# Altium schematic sheet Sheet2.SchDoc
size A4
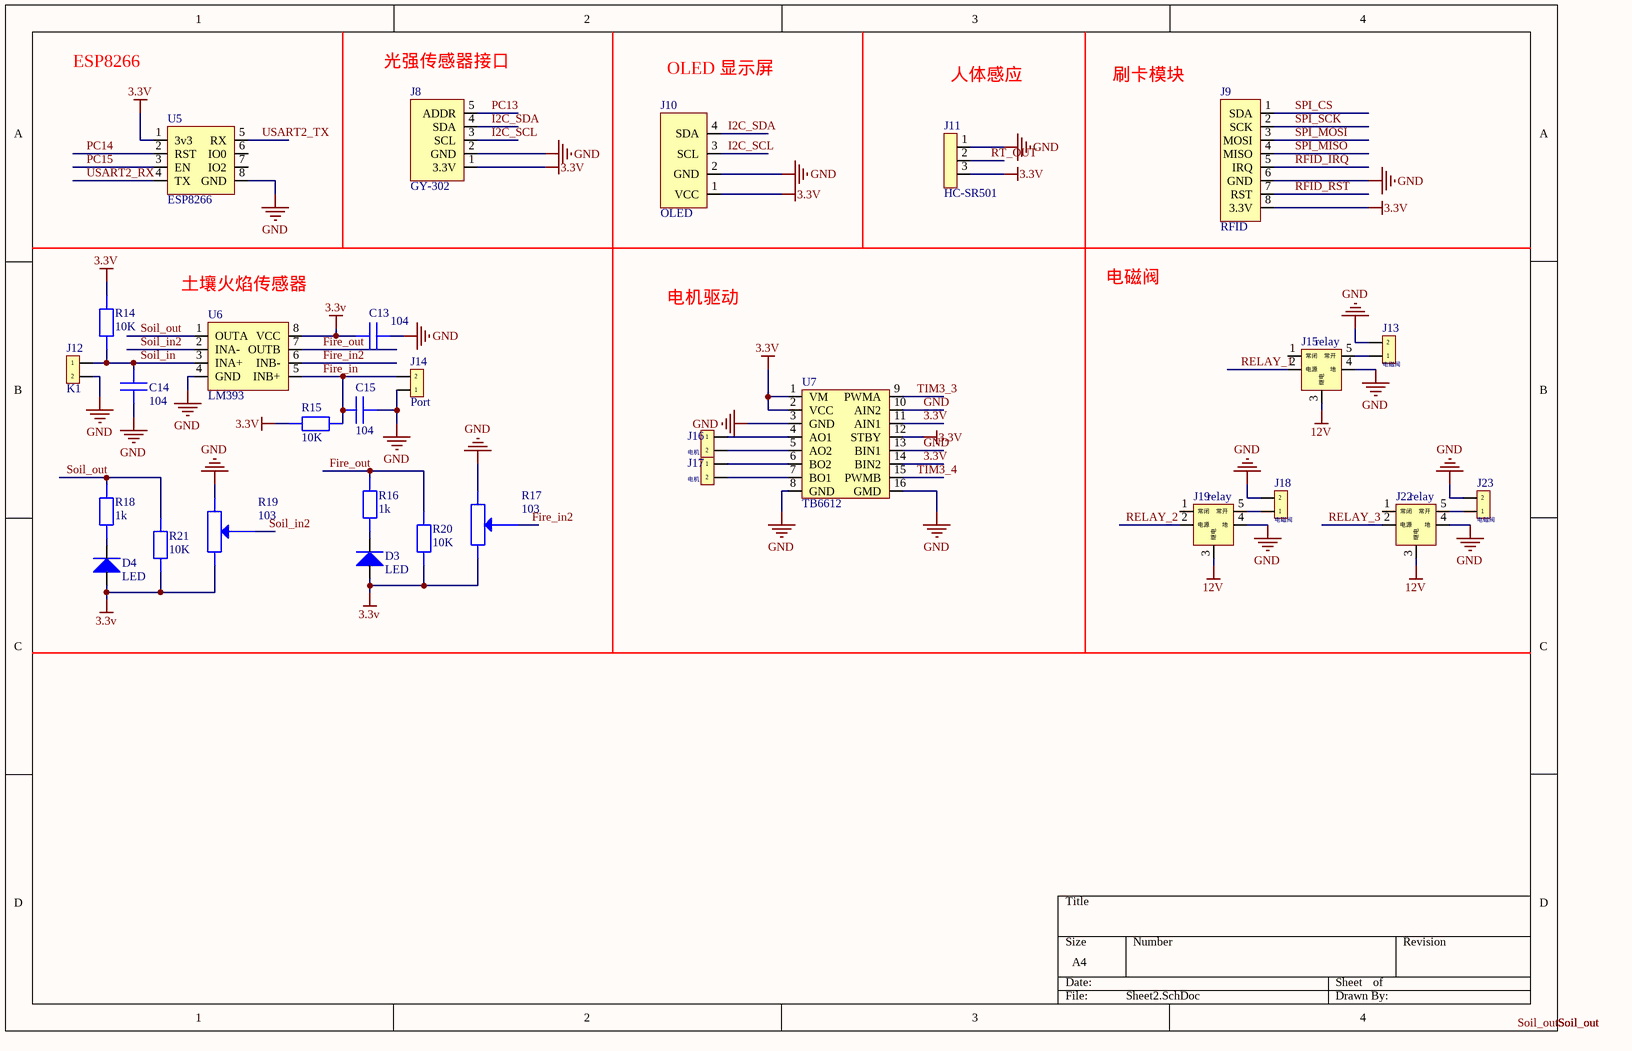
[diagram p0: Sheet2.SchDoc]

## Parts
C13  104  [CAP_0603_FIRE]
C14  104  [CAP_0603_FIRE]
C15  104  [CAP_0603_FIRE]
D3  LED  [LED_Z]
D4  LED  [LED_Z]
J8  GY-302  [GY]
J9  RFID  [RFID]
J10  OLED  [OLED]
J11  HC-SR501  [HDR1X3]
J12  K1  [port_2]
J13  电磁阀  [port_2]
J14  Port  [port_2]
J15  relay  [relay]
J16  电机  [port_2]
J17  电机  [port_2]
J18  电磁阀  [port_2]
J19  relay  [relay]
J22  relay  [relay]
J23  电磁阀  [port_2]
R14  10K  [R_0603]
R15  10K  [R_0603]
R16  1k  [R_0603]
R17  103  [RES_R]
R18  1k  [R_0603]
R19  103  [RES_R]
R20  10K  [R_0603]
R21  10K  [R_0603]
U5  ESP8266  [ESP8266]
U6  LM393  [LM393]
U7  TB6612  [TB6612]

## Nets
3.3V: C13.1 D3.1 D4.1 J8.1(3.3V) J9.8(3.3V) J10.1(VCC) J11.3 R14.2 R15.1 R17.2(VCC) R19.2(VCC) R20.1 R21.1 U5.1(3v3) U6.8(VCC) U7.1(VM) U7.2(VCC) U7.11(AIN1) U7.12(STBY) U7.14(BIN2)
12V: J15.3(继电) J19.3(继电) J22.3(继电)
GND: C13.2 C14.1 C15.2 J8.2(GND) J9.6(GND) J10.2(GND) J11.1 J12.2 J13.2 J14.1 J15.4(地) J18.2 J19.4(地) J22.4(地) J23.2 R17.1(VCC) R19.1(VCC) U5.8(GND) U6.4(GND) U7.3(GND) U7.8(GND) U7.10(AIN2) U7.13(BIN1) U7.16(GMD)
Fire_in: C15.1 J14.2 R15.2 U6.5(INB+)
Fire_in2: R17.3(VCC) U6.6(INB-)
Fire_out: R16.2 R20.2 U6.7(OUTB)
I2C_SCL: J8.3(SCL) J10.3(SCL)
I2C_SDA: J8.4(SDA) J10.4(SDA)
PC13: J8.5(ADDR)
PC14: U5.2(RST)
PC15: U5.3(EN)
RELAY_1: J15.2(电源)
RELAY_2: J19.2(电源)
RELAY_3: J22.2(电源)
RFID_IRQ: J9.5(IRQ)
RFID_RST: J9.7(RST)
RT_OUT: J11.2
Soil_in: C14.2 J12.1 R14.1 U6.3(INA+)
Soil_in2: R19.3(VCC) U6.2(INA-)
Soil_out: R18.2 R21.2 U6.1(OUTA)
SPI_CS: J9.1(SDA)
SPI_MISO: J9.4(MISO)
SPI_MOSI: J9.3(MOSI)
SPI_SCK: J9.2(SCK)
TIM3_3: U7.9(PWMA)
TIM3_4: U7.15(PWMB)
USART2_RX: U5.4(TX)
USART2_TX: U5.5(RX)
NetD3_2: D3.2 R16.1
NetD4_2: D4.2 R18.1
NetJ13_1: J13.1 J15.5(常开)
NetJ16_1: J16.1 U7.4(AO1)
NetJ16_2: J16.2 U7.5(AO2)
NetJ17_1: J17.1 U7.6(BO2)
NetJ17_2: J17.2 U7.7(BO1)
NetJ18_1: J18.1 J19.5(常开)
NetJ22_5: J22.5(常开) J23.1

Not connected (* = marked no-connect by the designer): J15 1(常闭); J19 1(常闭); J22 1(常闭); U5 6(IO0) 7(IO2)

## Notes on the sheet
- ESP8266
- (near J8) 光强传感器接口
- OLED 显示屏
- 人体感应
- 刷卡模块
- (near U6) 土壤火焰传感器
- 电机驱动
- 电磁阀
- Labels drawn without touching a wire or pin: Soil_out

## Library data of the parts
C13-C15 = Capacitance
J12 J13 J16-J18 J23 = port_2
R14-R16 R18 R20 R21 = RES
R17 R19 = RES_R